# Altium schematic sheet EEPROM.SCHDOC
size 297 x 209 mm; SheetNumber: 5; SheetTotal: 5; DocumentName: EEPROM.SCHDOC
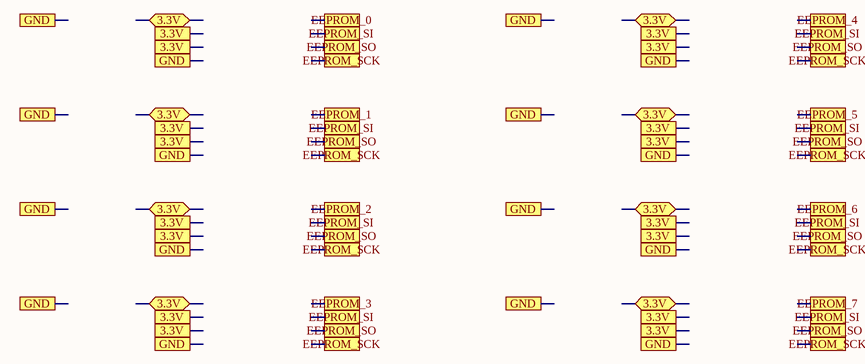
[diagram p0: EEPROM.SCHDOC]

## Ports
3.3V, 3.3V (bidir), EEPROM_0, EEPROM_1, EEPROM_2, EEPROM_3, EEPROM_4, EEPROM_5, EEPROM_6, EEPROM_7, EEPROM_SCK, EEPROM_SI, EEPROM_SO, GND

## Notes on the sheet
- A
- B
- C
- D
- 1
- 2
- 3
- Title
- 4
- Size
- A4
- Number
- Rev
- Date
- Filename
- Drawn by
- Sheet
- of